# Altium project Dyn_Mic.PrjPCB
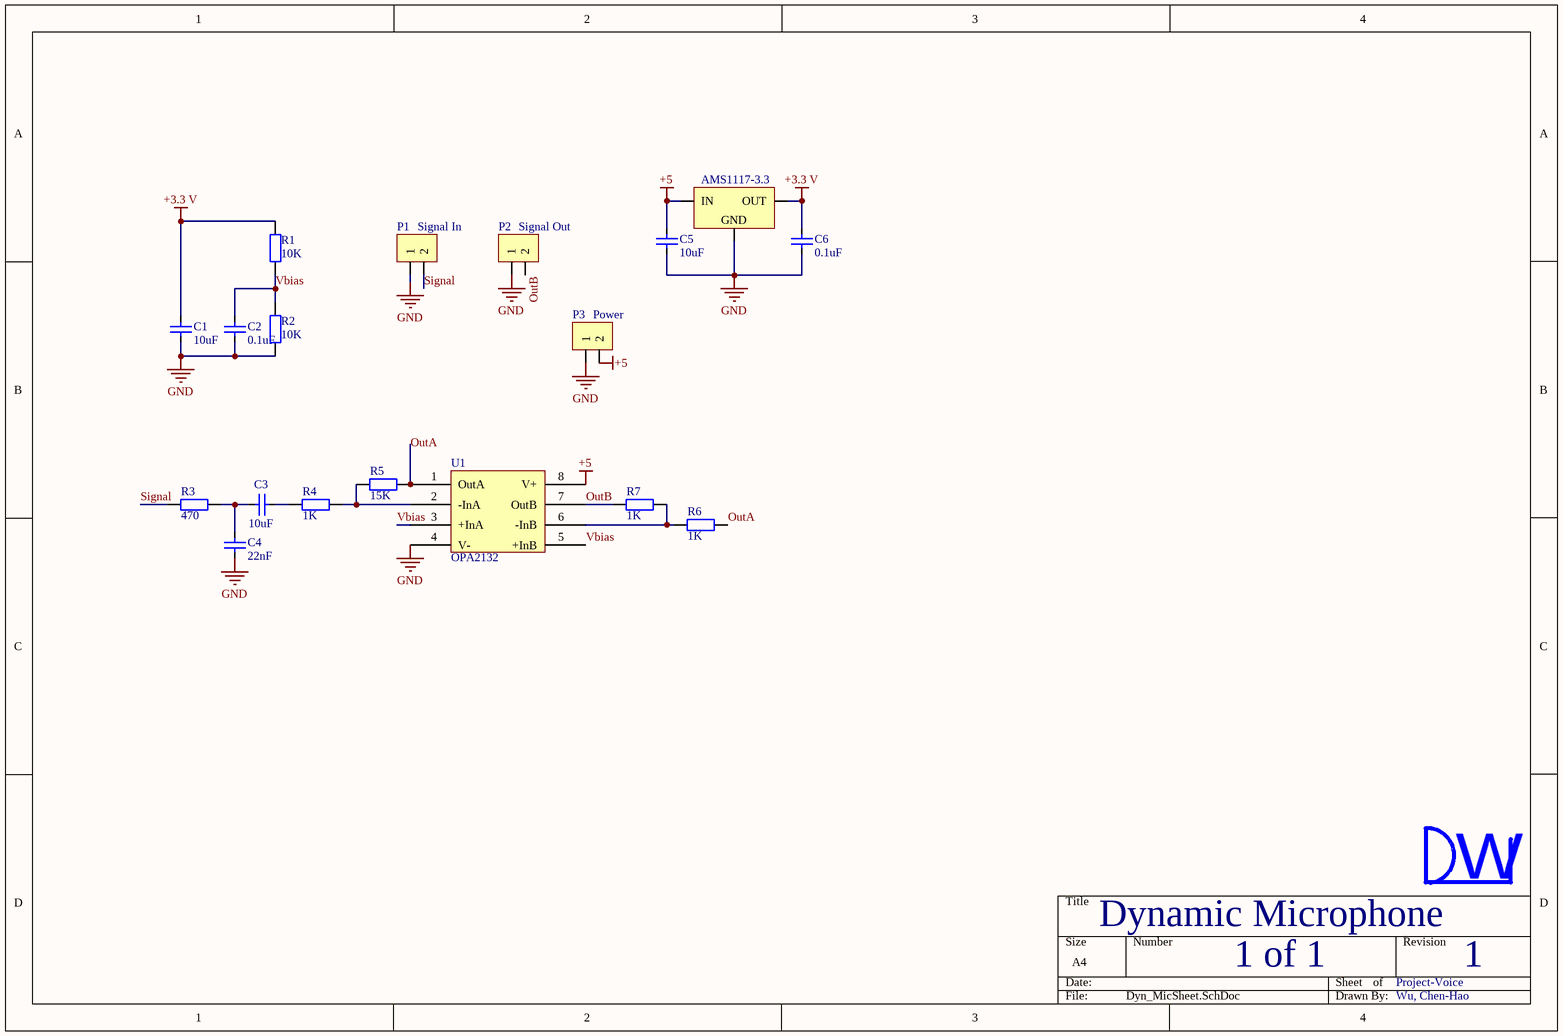
[diagram p0: Dyn_MicSheet.SchDoc]
1 sheet, 19 parts. Net scope: global (net labels, ports and power ports of the same name join across sheets).
Board file: Dyn_MicPCB.PcbDoc

## Sheet Dyn_MicSheet.SchDoc
size A4

### Parts
*  DHW_MARK  (value not drawn)
AMS1  AMS1117-3.3  [SOT223]
C1  value 10uF  [CAP_0603]  (hidden comment: Cap_0603)
C2  value 0.1uF  [CAP_0603]  (hidden comment: Cap_0603)
C3  value 10uF  [CAP_0603]  (hidden comment: Cap_0603)
C4  value 22nF  [CAP_0603]  (hidden comment: Cap_0603)
C5  value 10uF  [CAP_0603]  (hidden comment: Cap_0603)
C6  value 0.1uF  [CAP_0603]  (hidden comment: Cap_0603)
P1  Signal In  [HDR1X2_180_2.54]
P2  Signal Out  [HDR1X2_180_2.54]
P3  Power  [HDR1X2_180_2.54]
R1  value 10K  [RES_0603]  (hidden comment: Res_0603)
R2  value 10K  [RES_0603]  (hidden comment: Res_0603)
R3  value 470  [RES_0603]  (hidden comment: Res_0603)
R4  value 1K  [RES_0603]  (hidden comment: Res_0603)
R5  value 15K  [RES_0603]  (hidden comment: Res_0603)
R6  value 1K  [RES_0603]  (hidden comment: Res_0603)
R7  value 1K  [RES_0603]  (hidden comment: Res_0603)
U1  OPA2132  [DIP_8]

### Nets
+3.3 V: AMS1.2(OUT) C1.2 C6.2 R1.2
+5: AMS1.3(IN) C5.2 P3.2 U1.8(V+)
GND: AMS1.1(GND) C1.1 C2.1 C4.1 C5.1 C6.1 P1.1 P2.1 P3.1 R2.1 U1.4(V-)
OutA: R5.1 R6.1 U1.1(OutA)
OutB: P2.2 R7.2 U1.7(OutB)
Signal: P1.2 R3.2
Vbias: C2.2 R1.1 R2.2 U1.3(+InA) U1.5(+InB)
NetC3_1: C3.1 R4.2
NetC3_2: C3.2 C4.2 R3.1
NetR4_1: R4.1 R5.2 U1.2(-InA)
NetR6_2: R6.2 R7.1 U1.6(-InB)

### Notes on the sheet
- (near *) Dynamic Microphone
- 1 of 1
- Project-Voice
- 1
- Wu, Chen-Hao
- (in symbol DHW_MARK) W

### Library data of the parts
AMS1 = AMS1117: Power
C1-C6 = Cap_0603: Capacitor
P1-P3 = HDR1X2_180_2.54: Header
R1-R7 = Res_0603: Resistor
U1 = OPA2132: TI BB OPA2132 - 2 op amps IC